# EAGLE schematic NanoRS485-MySens-v010-both-connectors (EAGLE 7.6.0)
MAPLE-CUx Large Version
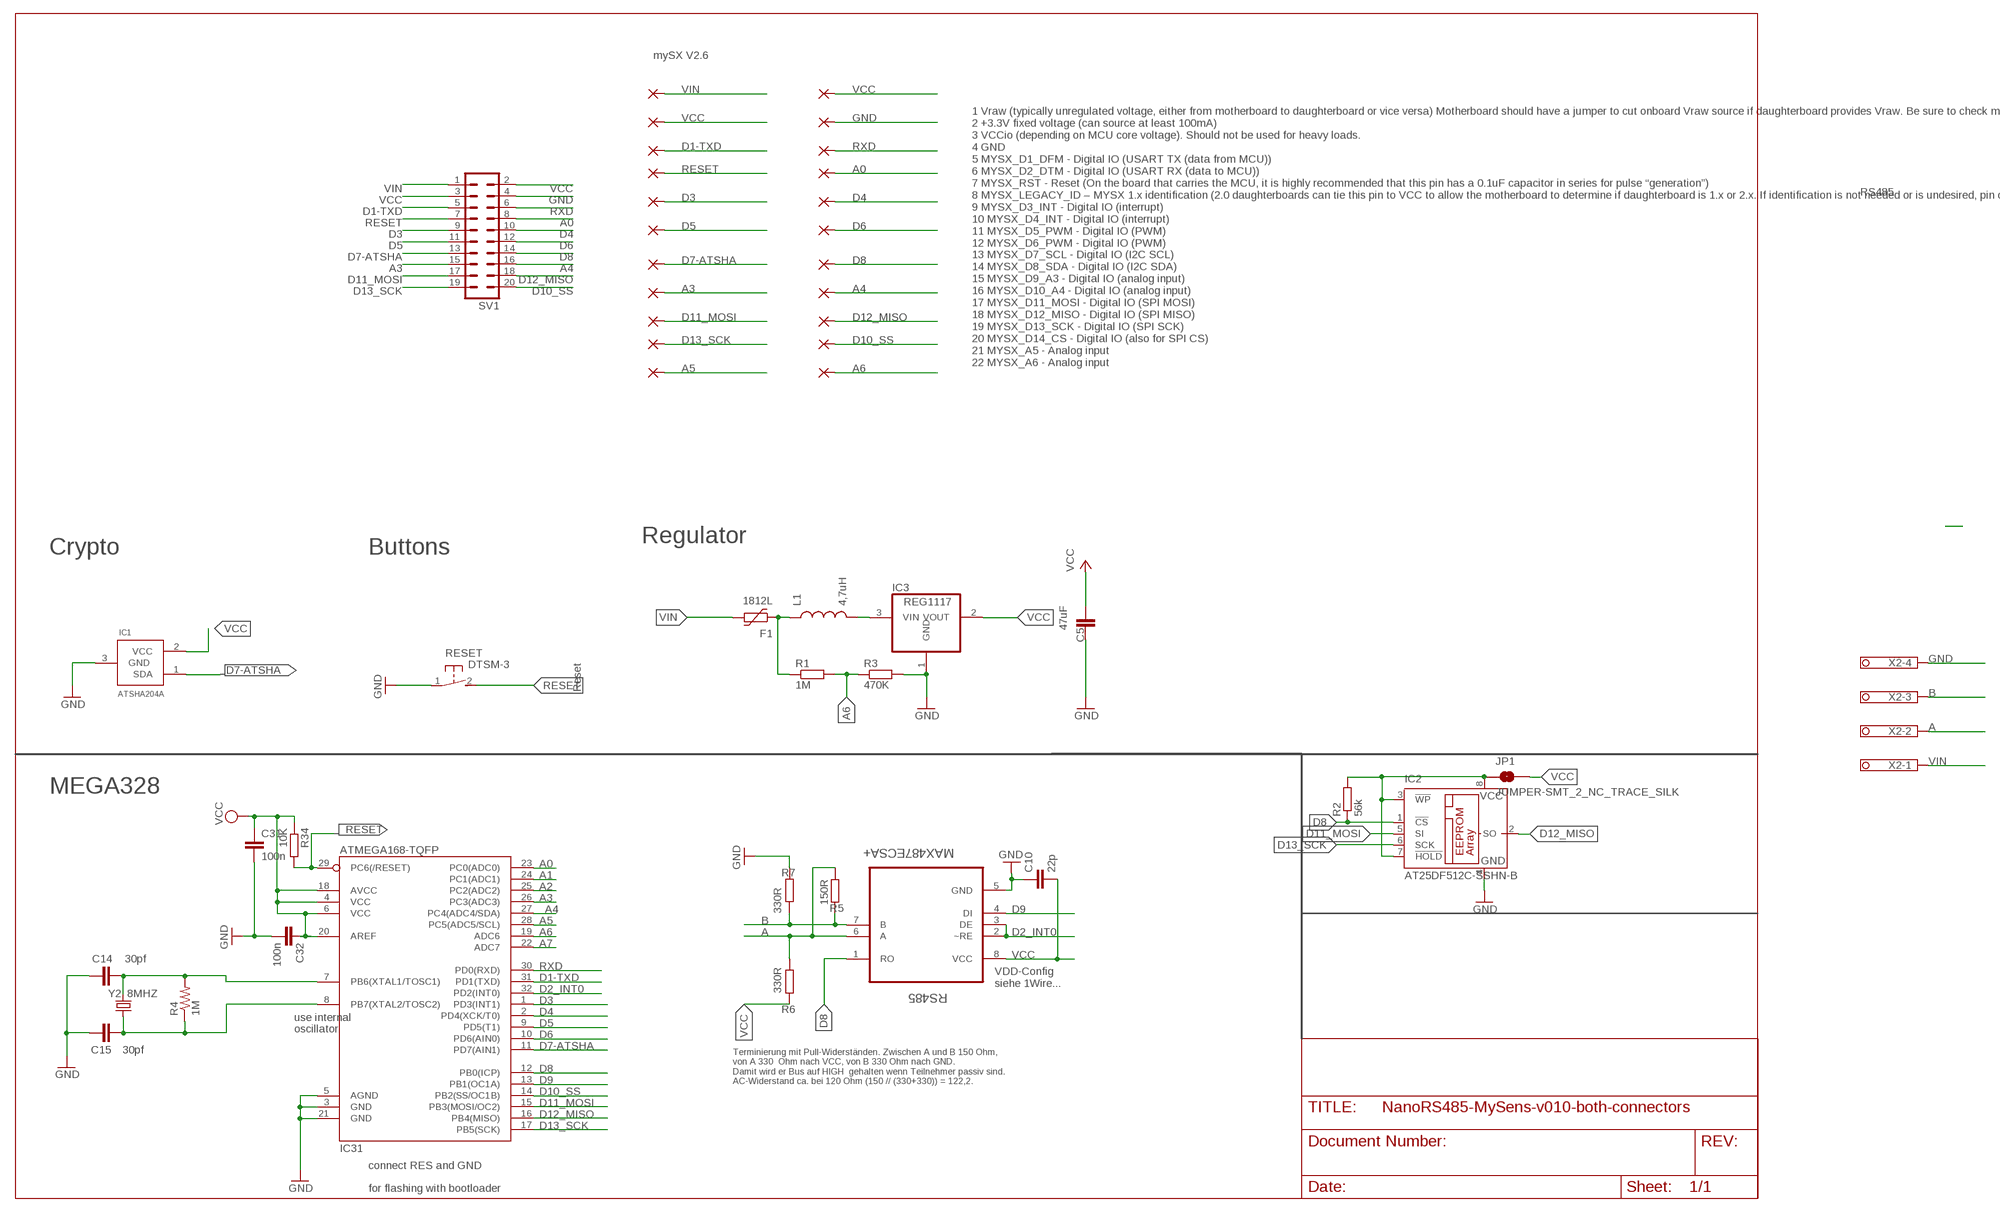
[diagram p0: schematic, sheet 1]

## Parts
3V3  WIREPADSMD1,27-254  [SMD1,27-2,54]
A3  WIREPADSMD1,27-254  [SMD1,27-2,54]
A4  WIREPADSMD1,27-254  [SMD1,27-2,54]
A5  WIREPADSMD1,27-254  [SMD1,27-2,54]
A6  WIREPADSMD1,27-254  [SMD1,27-2,54]
C5  47uF  C-EUC1210  [C1210]
C10  22p  C-EUC0805  [C0805]
C14  30pf  CAP0805  [0805]
C15  30pf  CAP0805  [0805]
C31  100n  C-EUC0805  [C0805]
C32  100n  C-EUC0805  [C0805]
D1  WIREPADSMD1,27-254  [SMD1,27-2,54]
D2  WIREPADSMD1,27-254  [SMD1,27-2,54]
D3  WIREPADSMD1,27-254  [SMD1,27-2,54]
D4  WIREPADSMD1,27-254  [SMD1,27-2,54]
D5  WIREPADSMD1,27-254  [SMD1,27-2,54]
D6  WIREPADSMD1,27-254  [SMD1,27-2,54]
D7  WIREPADSMD1,27-254  [SMD1,27-2,54]
D8  WIREPADSMD1,27-254  [SMD1,27-2,54]
D10-SS  WIREPADSMD1,27-254  [SMD1,27-2,54]
D11  WIREPADSMD1,27-254  [SMD1,27-2,54]
D12  WIREPADSMD1,27-254  [SMD1,27-2,54]
D13-SCK  WIREPADSMD1,27-254  [SMD1,27-2,54]
F1  1812L  [1812L]
GND  WIREPADSMD1,27-254  [SMD1,27-2,54]
IC1  ATSHA204A  [SOT23]
IC2  AT25DF512C-SSHN-B  25AA080SN  [SO-08]
IC3  REG1117  [SOT223]
IC31  ATMEGA168-TQFP  [TQFP32-08]
JP1  JUMPER-SMT_2_NC_TRACE_SILK  [SMT-JUMPER_2_NC_TRACE_SILK]
L1  4,7uH  INDUCTOR0805  [0805]
R1  1M  R-EU_R0805  [R0805]
R2  56k  R-EU_M0805  [M0805]
R3  470K  R-EU_R0805  [R0805]
R4  1M  RESISTOR0805-RES  [0805]
R5  150R  R-EU_R0805  [R0805]
R6  330R  R-EU_R0805  [R0805]
R7  330R  R-EU_R0805  [R0805]
R34  10K  R-EU_R0805  [R0805]
RES  WIREPADSMD1,27-254  [SMD1,27-2,54]
RESET  DTSM-3  [DTSM-3]
RS485  MAX487ECSA+  [SOIC127P600X175-8N]
SV1  MA10-2  [MA10-2]
VCC  WIREPADSMD1,27-254  [SMD1,27-2,54]
VCC-LEGACY  WIREPADSMD1,27-254  [SMD1,27-2,54]
VIN  WIREPADSMD1,27-254  [SMD1,27-2,54]
X2  1751264  [1751264]
Y2  8MHZ  CRYSTALTXC-7A  [CRYSTAL-TXC-7A]

## Nets
A: R5.1 R6.2 RS485.6(A) X2.2
A0: IC31.23(PC0(ADC0)) SV1.8 VCC-LEGACY.1(P)
A1: IC31.24(PC1(ADC1))
A2: IC31.25(PC2(ADC2))
A3: A3.1(P) IC31.26(PC3(ADC3)) SV1.15
A4: A4.1(P) IC31.27(PC4(ADC4/SDA)) SV1.16
A5: A5.1(P) IC31.28(PC5(ADC5/SCL))
A6: A6.1(P) IC31.19(ADC6) R1.2 R3.1
A7: IC31.22(ADC7)
B: R5.2 R7.1 RS485.7(B) X2.3
D1-TXD: D1.1(P) IC31.31(PD1(TXD)) SV1.5
D2_INT0: IC31.32(PD2(INT0)) RS485.2(~RE) RS485.3(DE)
D3: D3.1(P) IC31.1(PD3(INT1)) SV1.9
D4: D4.1(P) IC31.2(PD4(XCK/T0)) SV1.10
D5: D5.1(P) IC31.9(PD5(T1)) SV1.11
D6: D6.1(P) IC31.10(PD6(AIN0)) SV1.12
D7-ATSHA: D7.1(P) IC1.1(SDA) IC31.11(PD7(AIN1)) SV1.13
D8: D8.1(P) IC2.1(!CS) IC31.12(PB0(ICP)) R2.1 RS485.1(RO) SV1.14
D9: IC31.13(PB1(OC1A)) RS485.4(DI)
D10_SS: D10-SS.1(P) IC31.14(PB2(SS/OC1B)) SV1.20
D11_MOSI: D11.1(P) IC2.5(SI) IC31.15(PB3(MOSI/OC2)) SV1.17
D12_MISO: D12.1(P) IC2.2(SO) IC31.16(PB4(MISO)) SV1.18
D13_SCK: D13-SCK.1(P) IC2.6(SCK) IC31.17(PB5(SCK)) SV1.19
GND [PWR]: C5.1 C10.1 C14.1 C15.1 C31.2 C32.2 GND.1(P) IC1.3(GND) IC2.4(GND) IC3.1(GND) IC31.3(GND) IC31.5(AGND) IC31.21(GND) R3.2 R7.2 RESET.1 RS485.5(GND) SV1.4 X2.4
N$3: C14.2 IC31.7(PB6(XTAL1/TOSC1)) R4.2 Y2.P$2
N$19: C15.2 IC31.8(PB7(XTAL2/TOSC2)) R4.1 Y2.P$1
RAW: IC3.3(VIN) L1.2
RESET: IC31.29(PC6(/RESET)) R34.2 RES.1(P) RESET.2 SV1.7
RXD: D2.1(P) IC31.30(PD0(RXD)) SV1.6
VCC [PWR]: 3V3.1(P) C5.2 C10.2 C31.1 C32.1 IC1.2(VCC) IC3.2(VOUT) IC31.4(VCC) IC31.6(VCC) IC31.18(AVCC) IC31.20(AREF) JP1.2 R6.1 R34.1 RS485.8(VCC) SV1.2 SV1.3 VCC.1(P)
VCC1 [PWR]: IC2.3(!WP) IC2.7(!HOLD) IC2.8(VCC) JP1.1 R2.2
VIN [PWR]: F1.P$2 SV1.1 VIN.1(P) X2.1
VIN-FUSED [PWR]: F1.P$1 L1.1 R1.1

## Notes on the sheet
- mySX V2.6
- RS485
- 1 Vraw (typically unregulated voltage, either from motherboard to daughterboard or vice versa) Motherboard should have a jumper to cut onboard Vraw source if daughterboard provides Vraw. Be sure to check motherboard constraints on Vraw before connecting a daughterboard that provides Vraw (for over voltage protection). Should be able to source at least 100mA and all boards are recommended to support a voltage up to 24V on this pin.
  2 +3.3V fixed voltage (can source at least 100mA)
  3 VCCio (depending on MCU core voltage). Should not be used for heavy loads.
  4 GND
  5 MYSX_D1_DFM - Digital IO (USART TX (data from MCU))
  6 MYSX_D2_DTM - Digital IO (USART RX (data to MCU))
  7 MYSX_RST - Reset (On the board that carries the MCU, it is highly recommended that this pin has a 0.1uF capacitor in series for pulse “generation”)
  8 MYSX_LEGACY_ID – MYSX 1.x identification (2.0 daughterboards can tie this pin to VCC to allow the motherboard to determine if daughterboard is 1.x or 2.x. If identification is not needed or is undesired, pin can be used as regular analog input)
  9 MYSX_D3_INT - Digital IO (interrupt)
  10 MYSX_D4_INT - Digital IO (interrupt)
  11 MYSX_D5_PWM - Digital IO (PWM)
  12 MYSX_D6_PWM - Digital IO (PWM)
  13 MYSX_D7_SCL - Digital IO (I2C SCL)
  14 MYSX_D8_SDA - Digital IO (I2C SDA)
  15 MYSX_D9_A3 - Digital IO (analog input)
  16 MYSX_D10_A4 - Digital IO (analog input)
  17 MYSX_D11_MOSI - Digital IO (SPI MOSI)
  18 MYSX_D12_MISO - Digital IO (SPI MISO)
  19 MYSX_D13_SCK - Digital IO (SPI SCK)
  20 MYSX_D14_CS - Digital IO (also for SPI CS)
  21 MYSX_A5 - Analog input
  22 MYSX_A6 - Analog input
- Regulator
- Crypto | Buttons
- Reset
- MEGA328
- VDD-Config
  siehe 1Wire...
- use internal
- oscillator
- Terminierung mit Pull-Widerständen. Zwischen A und B 150 Ohm,
  von A 330  Ohm nach VCC, von B 330 Ohm nach GND. 
  Damit wird er Bus auf HIGH  gehalten wenn Teilnehmer passiv sind.
  AC-Widerstand ca. bei 120 Ohm (150 // (330+330)) = 122,2.
- connect RES and GND
- for flashing with bootloader

## Library data of the parts
3V3 A3-A6 D1-D8 D10-SS D11 D12 D13-SCK GND RES VCC VCC-LEGACY VIN = wirepad:WIREPAD: Wire PAD connect wire on PCB
C5 C10 C31 C32 = rcl:C-EU: CAPACITOR, European symbol
C14 C15 = doug:CAP: Capacitor Standard 0603 ceramic capacitor, and 0.1" leaded capacitor.
F1 = ptc-littlefuse:1812L
IC1 = Sensor:ATSHA204A
IC2 = microchip:25*: Serial EEPROM 4K/ 8K , SPI bus; MF: MICROCHIP; MPN: 25AA080/SN; OC_FARNELL: 1816072; OC_NEWARK: 92C7351
IC3 = burr-brown:REG1117: 800mA and 1A Low Dropout (LDO) Positive Regulator 1.8V, 2.5V, 2.85V, 3.3V, 5V, and Adj; MPN: REG1117; OC_FARNELL: 1097566; OC_NEWARK: 14P6981
IC31 = atmel:ATMEGA168: Atmel Atmega 168/328/328P
JP1 = SparkFun-Jumpers:JUMPER-SMT_2_NC_TRACE: Normally closed trace jumper This jumper has a trace between two pads so it's normally closed (NC). Use a razor knife to open the connection. For best results follow the IPC guidelines for cutting traces: Cutout at least 0.063 mm (0.005 in). Remove all loose material to clean up the cut area. Seal the cut with an approved epoxy. Reapply solder to reclose the connection.
L1 = SparkFun-Passives:INDUCTOR: Inductors Basic Inductor/Choke - 0603 and 1206. Footprints are not proven and vary greatly between part numbers.
R1 R3 R5-R7 R34 = rcl:R-EU_: RESISTOR, European symbol
R2 = resistor:R-EU_: RESISTOR, European symbol
R4 = doug:RESISTOR: Resistor Basic schematic elements and footprints for 0603, 1206, and PTH resistors.
RESET = mechanics:DTSM-3: Diptronics SMD button 6x3.5 mm
RS485 = Maxim_By_element14_Batch_1:MAX487ECSA+: Low-Power, Slew-Rate-Limited RS-485/RS-422 Transceivers; MPN: MAX487ECSA+; OC_FARNELL: 9724532; OC_NEWARK: 68K4803; PACKAGE: SOIC-8; SUPPLIER: Maxim
SV1 = con-lstb:MA10-2: PIN HEADER; OC_FARNELL: unknown; OC_NEWARK: unknown
X2 = con-phoenix-350:1751264: MKDS 1/ 4-3,5 Printklemme Nennstrom: 10 A Bemessungsspannung: 160 V Raster: 3,5 mm Polzahl: 4 Montageart: Löten Anschlussart: Schraubanschluss Anschlussrichtung vom Leiter zur Platine: 0° Source: http://eshop.phoenixcontact.com .. 1751264.pdf; MPN: 1751264; OC_FARNELL: unknown; OC_NEWARK: 10R0934
Y2 = SparkFun-FreqCtrl:CRYSTAL: Various standard crystals. Proven footprints.

## Net classes
0 default: width 0.254 mm
1 PWR: width 0.406 mm